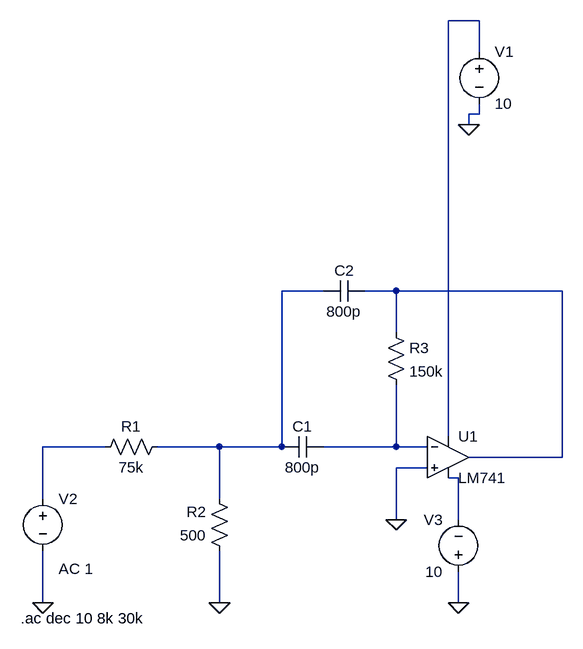
[diagram p0: schematic Bandpass circuit.asc]
Bandpass circuit.asc, the LTspice schematic file:
Version 4
SHEET 1 880 680
WIRE 240 -512 192 -512
WIRE 240 -464 240 -512
WIRE 240 -368 240 -384
WIRE 240 -368 224 -368
WIRE 224 -352 224 -368
WIRE 0 -96 -64 -96
WIRE 112 -96 64 -96
WIRE 368 -96 112 -96
WIRE 112 -32 112 -96
WIRE 192 128 192 -512
WIRE -336 144 -432 144
WIRE -160 144 -256 144
WIRE -64 144 -64 -96
WIRE -64 144 -160 144
WIRE 112 144 112 48
WIRE 112 144 0 144
WIRE 160 144 112 144
WIRE 368 160 368 -96
WIRE 368 160 224 160
WIRE 160 176 112 176
WIRE 208 192 192 192
WIRE -432 224 -432 144
WIRE -160 224 -160 144
WIRE 112 256 112 176
WIRE 208 256 208 192
WIRE -432 384 -432 304
WIRE -160 384 -160 304
WIRE 208 384 208 336
FLAG 224 -352 0
FLAG -160 384 0
FLAG 112 256 0
FLAG -432 384 0
FLAG 208 384 0
SYMBOL BEE215\\LM741 192 96 R0
SYMATTR InstName U1
SYMBOL voltage 240 -480 R0
WINDOW 123 0 0 Left 0
WINDOW 39 0 0 Left 0
SYMATTR InstName V1
SYMATTR Value 10
SYMBOL cap 0 128 R90
WINDOW 0 0 32 VBottom 2
WINDOW 3 32 32 VTop 2
SYMATTR InstName C1
SYMATTR Value 800p
SYMBOL res 96 -48 R0
SYMATTR InstName R3
SYMATTR Value 150k
SYMBOL cap 64 -112 R90
WINDOW 0 0 32 VBottom 2
WINDOW 3 32 32 VTop 2
SYMATTR InstName C2
SYMATTR Value 800p
SYMBOL res -240 128 R90
WINDOW 0 0 56 VBottom 2
WINDOW 3 32 56 VTop 2
SYMATTR InstName R1
SYMATTR Value 75k
SYMBOL res -144 320 R180
WINDOW 0 36 76 Left 2
WINDOW 3 36 40 Left 2
SYMATTR InstName R2
SYMATTR Value 500
SYMBOL voltage -432 208 R0
WINDOW 123 24 124 Left 2
WINDOW 39 0 0 Left 0
SYMATTR InstName V2
SYMATTR Value ""
SYMATTR Value2 AC 1
SYMBOL voltage 208 352 R180
WINDOW 0 24 96 Left 2
WINDOW 3 24 16 Left 2
WINDOW 123 0 0 Left 0
WINDOW 39 0 0 Left 0
SYMATTR InstName V3
SYMATTR Value 10
TEXT -466 408 Left 2 !.ac dec 10 8k 30k

The netlist it stands for:
* Bandpass circuit.asc
XU1 0 N005 N001 N006 N003 LM741  ; pins In+ In- V+ V- OUT
V1 N001 0 10
C1 N005 N002 800p
R3 N003 N005 150k
C2 N003 N002 800p
R1 N002 N004 75k
R2 0 N002 500
V2 N004 0 AC 1
V3 0 N006 10
.ac dec 10 8k 30k
.lib LM741.lib
.backanno
.end